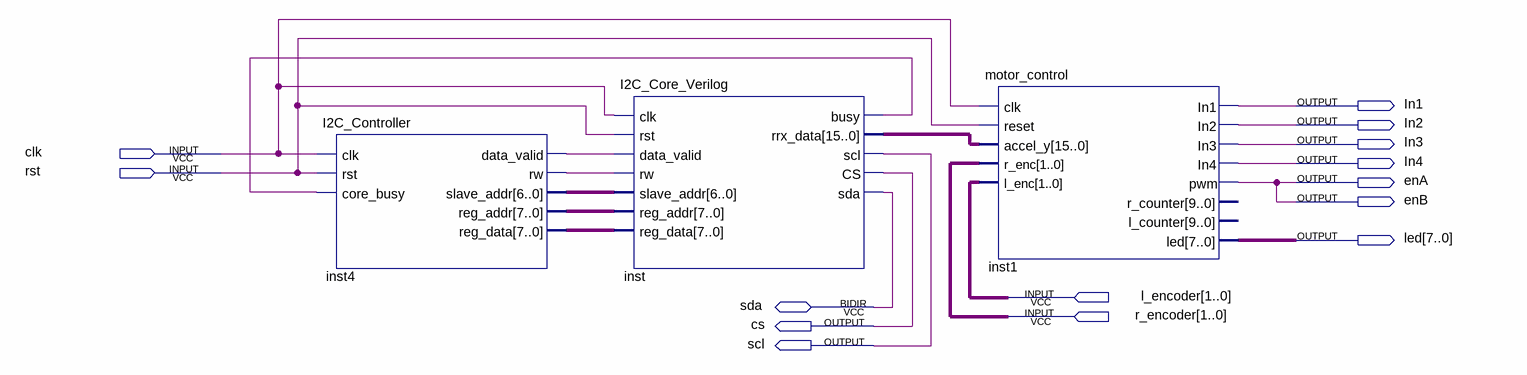
[diagram p0: schematic sheet]
// Quartus schematic control-systems-fpga.bdf as structural Verilog: 3 symbols, 14 pins
module \control-systems-fpga  (
  input  clk,
  input  rst,
  input  [1:0] l_encoder,
  input  [1:0] r_encoder,
  inout  sda,
  output In1,
  output In2,
  output In3,
  output In4,
  output enA,
  output enB,
  output [7:0] led,
  output cs,
  output scl
);

  wire inst4_data_valid, inst4_rw, inst_busy;
  wire [6:0] inst4_slave_addr;
  wire [7:0] inst4_reg_addr, inst4_reg_data;
  wire [15:0] inst_rrx_data;

  I2C_Controller inst4 (
    .clk(clk), .rst(rst), .core_busy(inst_busy), .data_valid(inst4_data_valid), .rw(inst4_rw),
    .slave_addr(inst4_slave_addr), .reg_addr(inst4_reg_addr), .reg_data(inst4_reg_data));
  I2C_Core_Verilog inst (
    .clk(clk), .rst(rst), .data_valid(inst4_data_valid), .rw(inst4_rw), .slave_addr(inst4_slave_addr),
    .reg_addr(inst4_reg_addr), .reg_data(inst4_reg_data), .busy(inst_busy), .rrx_data(inst_rrx_data),
    .scl(scl), .CS(cs), .sda(sda));
  motor_control inst1 (
    .clk(clk), .reset(rst), .accel_y(inst_rrx_data), .r_enc(r_encoder), .l_enc(l_encoder), .In1(In1),
    .In2(In2), .In3(In3), .In4(In4), .pwm(enA), .led(led));  // open: r_counter, l_counter

  assign enB = enA;
endmodule
